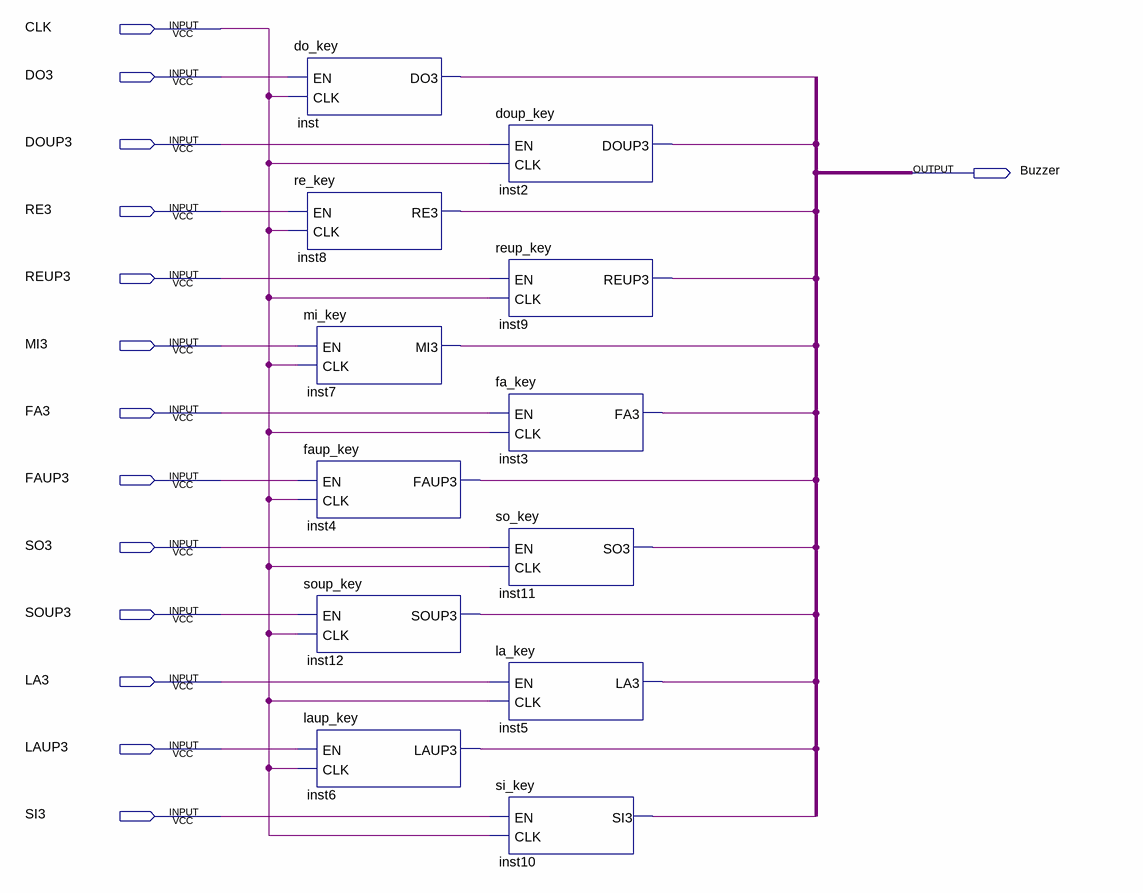
[diagram p0: schematic sheet]
// Quartus schematic bmelody.bdf as structural Verilog: 12 symbols, 14 pins
module bmelody (
  input  CLK,
  input  DO3,
  input  DOUP3,
  input  RE3,
  input  REUP3,
  input  MI3,
  input  FA3,
  input  FAUP3,
  input  SO3,
  input  SOUP3,
  input  LA3,
  input  LAUP3,
  input  SI3,
  output Buzzer
);

  do_key inst (.EN(DO3), .CLK(CLK), .DO3(Buzzer));
  re_key inst8 (.EN(RE3), .CLK(CLK), .RE3(Buzzer));
  mi_key inst7 (.EN(MI3), .CLK(CLK), .MI3(Buzzer));
  faup_key inst4 (.EN(FAUP3), .CLK(CLK), .FAUP3(Buzzer));
  soup_key inst12 (.EN(SOUP3), .CLK(CLK), .SOUP3(Buzzer));
  laup_key inst6 (.EN(LAUP3), .CLK(CLK), .LAUP3(Buzzer));
  doup_key inst2 (.EN(DOUP3), .CLK(CLK), .DOUP3(Buzzer));
  reup_key inst9 (.EN(REUP3), .CLK(CLK), .REUP3(Buzzer));
  fa_key inst3 (.EN(FA3), .CLK(CLK), .FA3(Buzzer));
  so_key inst11 (.EN(SO3), .CLK(CLK), .SO3(Buzzer));
  la_key inst5 (.EN(LA3), .CLK(CLK), .LA3(Buzzer));
  si_key inst10 (.EN(SI3), .CLK(CLK), .SI3(Buzzer));
endmodule
